# Altium schematic sheet OTHER PARTS.SchDoc
size A3; SheetNumber: 2; SheetTotal: 2
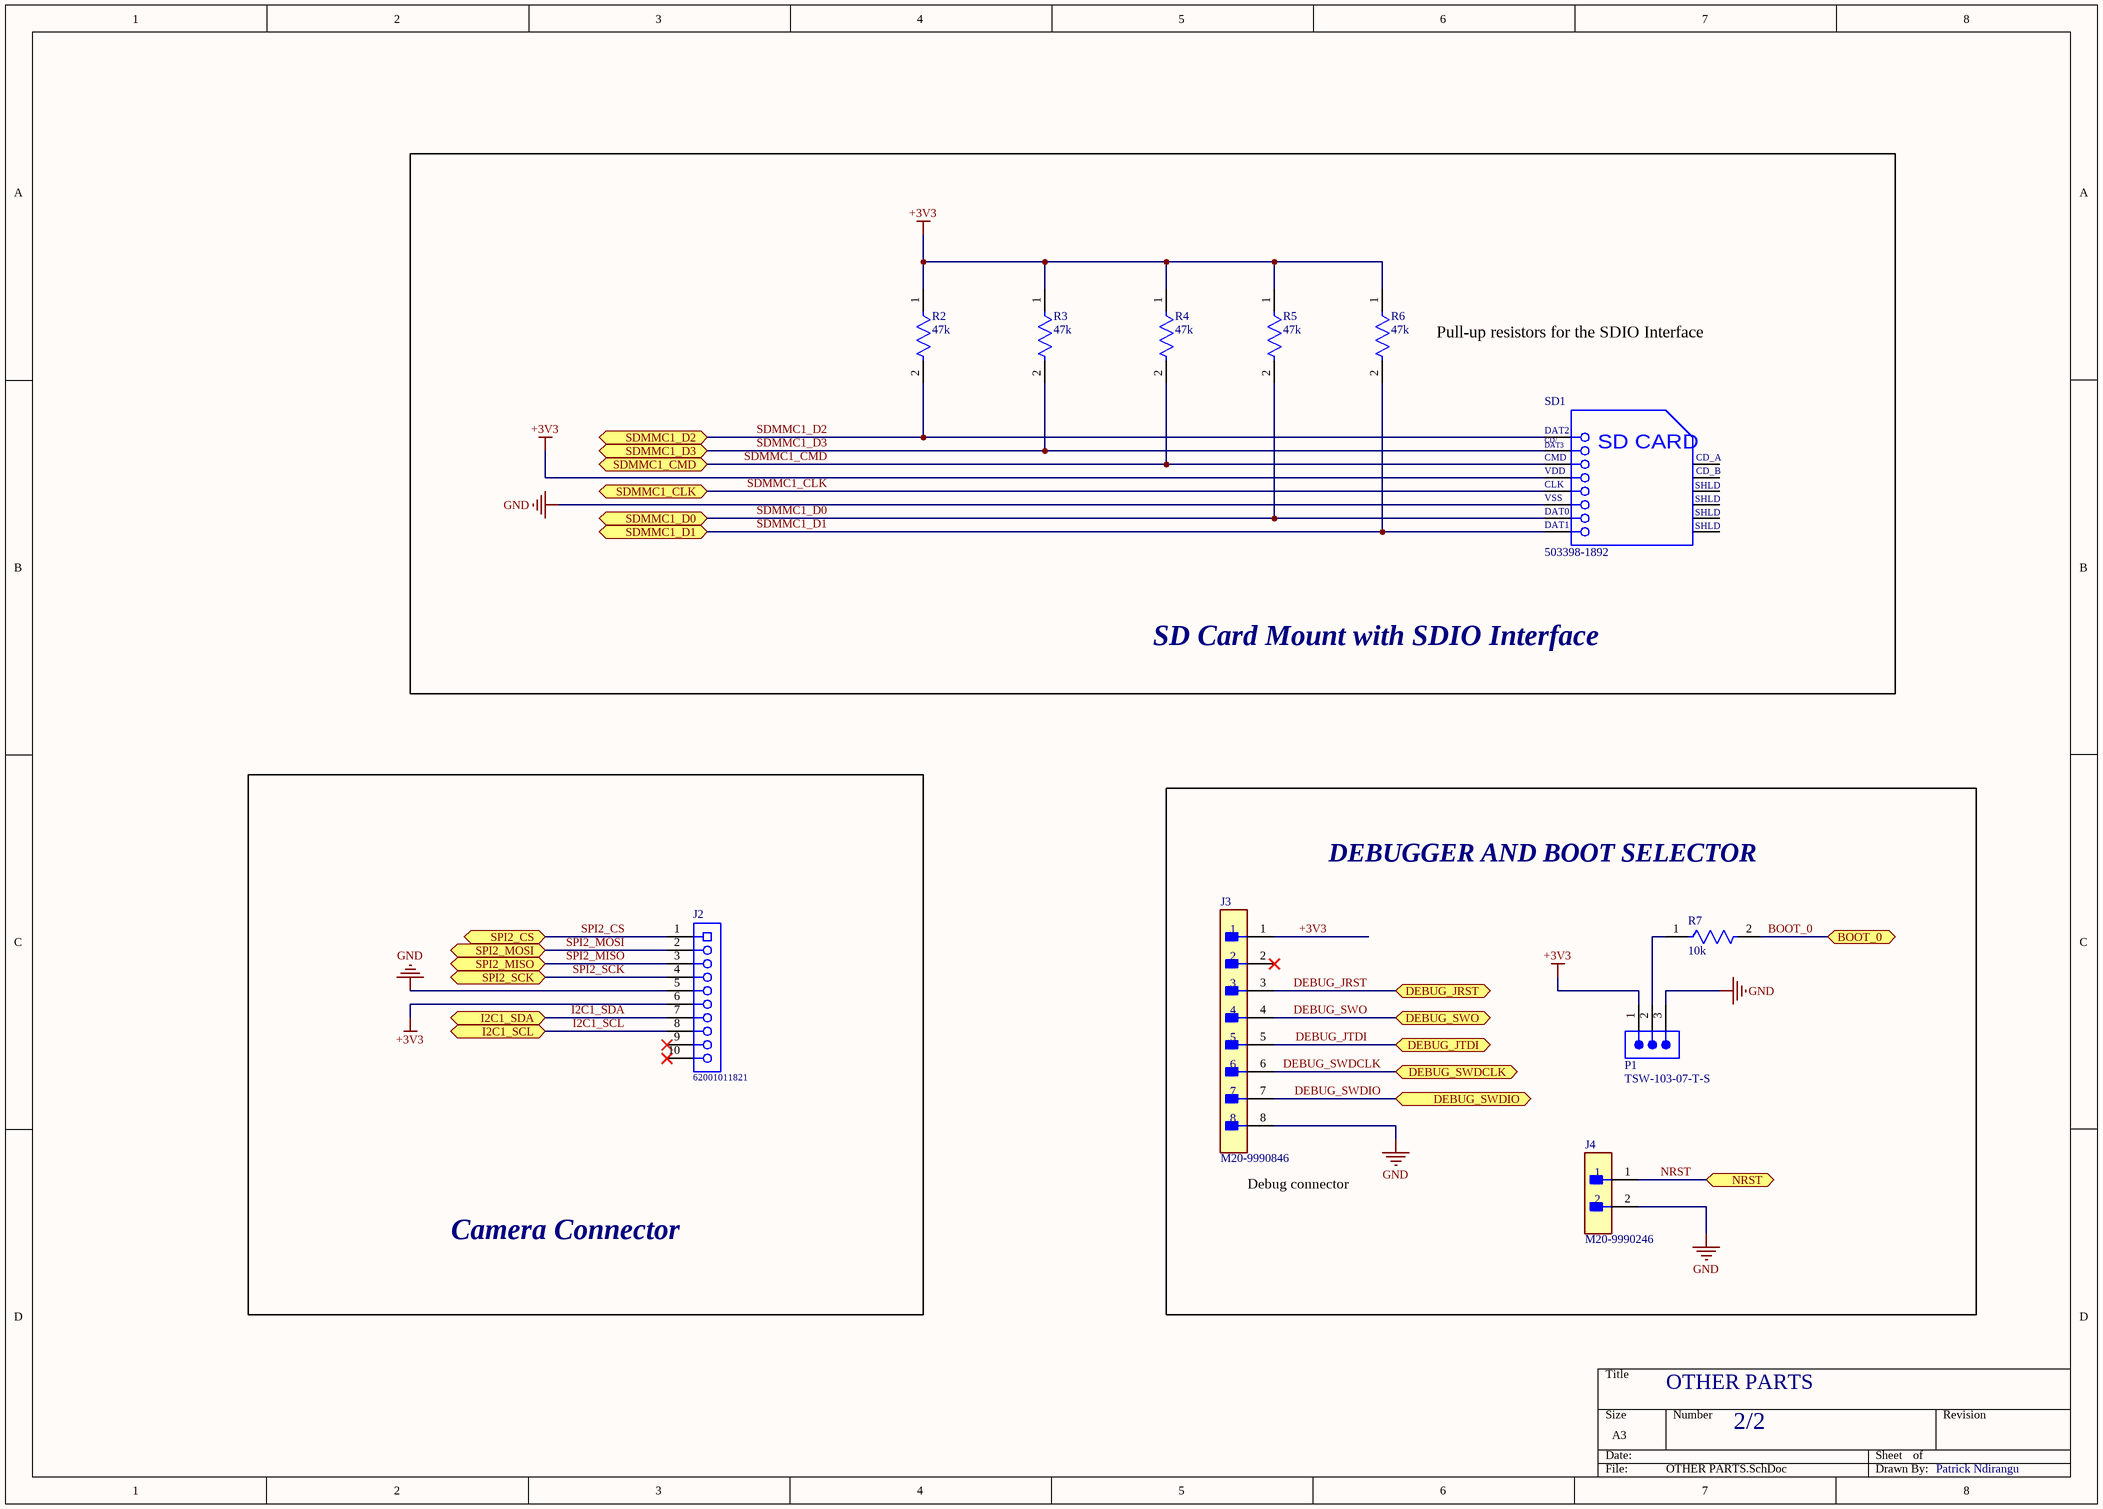
[diagram p0: OTHER PARTS.SchDoc]

## Parts
J2  62001011821  [62001011821]
J3  M20-9990846  [FP-M20-9990846-MFG]
J4  M20-9990246  [FP-M20-9990246-MFG]
P1  TSW-103-07-T-S  [SMTC-TSW-103-07-X-S]
R2  47k  [FP-KTR03-IPC_C]
R3  47k  [FP-KTR03-IPC_C]
R4  47k  [FP-KTR03-IPC_C]
R5  47k  [FP-KTR03-IPC_C]
R6  47k  [FP-KTR03-IPC_C]
R7  10k  [FP-SFR03-MFG]
SD1  503398-1892  [MOLX-503398-1892_V]

## Blocks framed on the sheet
SD Card Mount with SDIO Interface: R2-R6 SD1
Camera Connector: J2
DEBUGGER AND BOOT SELECTOR: J3 J4 P1 R7

## Ports
BOOT_0 (bidir, see MCU[3C]), DEBUG_JRST (bidir, see MCU[3C]), DEBUG_JTDI (bidir, see MCU[1C]), DEBUG_SWDCLK (bidir, see MCU[1C]), DEBUG_SWDIO (bidir, see MCU[1C]), DEBUG_SWO (bidir, see MCU[3C]), I2C1_SCL (bidir, see MCU[3C]), I2C1_SDA (bidir, see MCU[3C]), NRST (bidir, see MCU[3D]), SDMMC1_CLK (bidir, see MCU[1D]), SDMMC1_CMD (bidir, see MCU[3C]), SDMMC1_D0 (bidir, see MCU[1C]), SDMMC1_D1 (bidir, see MCU[1C]), SDMMC1_D2 (bidir, see MCU[1D]), SDMMC1_D3 (bidir, see MCU[1D]), SPI2_CS (bidir, see MCU[3C]), SPI2_MISO (bidir, see MCU[1C]), SPI2_MOSI (bidir, see MCU[1C]), SPI2_SCK (bidir, see MCU[1C])

## Nets
+3V3: J2.6 J3.1 P1.1 R2.1 R3.1 R4.1 R5.1 R6.1 SD1.4(VDD)
GND: J2.5 J3.8 J4.2 P1.3 SD1.6(VSS)
BOOT_0: R7.2 ; port BOOT_0
DEBUG_JRST: J3.3 ; port DEBUG_JRST
DEBUG_JTDI: J3.5 ; port DEBUG_JTDI
DEBUG_SWDCLK: J3.6 ; port DEBUG_SWDCLK
DEBUG_SWDIO: J3.7 ; port DEBUG_SWDIO
DEBUG_SWO: J3.4 ; port DEBUG_SWO
I2C1_SCL: J2.8 ; port I2C1_SCL
I2C1_SDA: J2.7 ; port I2C1_SDA
NRST: J4.1 ; port NRST
SDMMC1_CLK: SD1.5(CLK) ; port SDMMC1_CLK
SDMMC1_CMD: R4.2 SD1.3(CMD) ; port SDMMC1_CMD
SDMMC1_D0: R5.2 SD1.7(DAT0) ; port SDMMC1_D0
SDMMC1_D1: R6.2 SD1.8(DAT1) ; port SDMMC1_D1
SDMMC1_D2: R2.2 SD1.1(DAT2) ; port SDMMC1_D2
SDMMC1_D3: R3.2 SD1.2(CD/DAT3) ; port SDMMC1_D3
SPI2_CS: J2.1 ; port SPI2_CS
SPI2_MISO: J2.3 ; port SPI2_MISO
SPI2_MOSI: J2.2 ; port SPI2_MOSI
SPI2_SCK: J2.4 ; port SPI2_SCK
NetP1_2: P1.2 R7.1

Not connected (* = marked no-connect by the designer): J2 9* 10*; J3 2*; SD1 9(CD_A) 10(CD_B) 11(SHLD) 12(SHLD) 13(SHLD) 14(SHLD)

## Notes on the sheet
- Pull-up resistors for the SDIO Interface
- (near J3) Debug connector
- OTHER PARTS
- 2/2
- Patrick Ndirangu
- (in symbol CMP-2000-05621-1) CD/; DAT3; SD CARD

## Library data of the parts
J2 = CMP-1502-01210-1: THT Vertical Socket Header WR-PHD, Pitch 2.00 mm, Single Row, 10 pins; Manufacturer: Wurth Elektronik; Withstanding Voltage: 500VAC; Gender: Female; Rated Current: 2A; Pin Number: 10; Pitch: 2.00mm; Contact Resistance: 20mOhm; Working Voltage: 250VAC; Mounting Technology: THT; Part Number: 62001011821; Orientation: Vertical; Operating Temperature: -40to105degC; Manufacturer URL: http://www.we-online.de; Publisher: WurthElektronik; Datasheet URL: https://katalog.we-online.de/em/datasheet/62001011821.pdf; Package Reference: 62001011821; Row Number: Single; Packaging: Tube
J3 = CMP-15831-000033-1: CONN HEADER VERT 8POS 2.54MM; Connector Type: Male Pin; Gender: Male; Insulation Resistance: 1GR; Number of Positions: 8; Contact Resistance: 30mR; Current Rating: 3A; Termination: Solder; Case/Package: SIL; RoHS Compliant: Yes; Series: M20; Housing Material: Nylon; Radiation Hardening: No; Package Quantity: 1000; Contact Material: Brass; Contact Plating: Tin; Max Operating Temperature: 105°C; Contact Mating Length: 0.24inch; Depth: 2.54mm; Color: Black; Number of Contacts: 8; Mount: Through Hole; Number of Rows: 1; Packaging: Bulk; Min Operating Temperature: -40°C; Max Current Rating: 3A; REACH SVHC: No SVHC; Pitch: 2.54mm; Housing Color: Black; Orientation: Straight; Length: 20.32mm; Contact Type: Male Pin
J4 = CMP-15831-000009-1: CONN HEADER VERT 2POS 2.54MM; Manufacturer: Harwin; Conn Gender: Male; Conn Orientation: Vertical; Number Of Contacts: 2; Current Rating: 3A; ComponentLink2URL: https://cdn.harwin.com/pdfs/M20-999.pdf; ComponentLink2Description: Datasheet; Package: M20-9990246; Temperature: -40°C to +105°C; Octopart: https://octopart.com/m20-9990246-harwin-2590635; Mouser Description: 2.54mm (0.1") Pitch SIL Vertical PC Tail Pin Header, 6.1mm mating pin height, tin, 2 contacts; Temperature Range High: +105°C; Device Class L1: Connectors; RoHS: TRUE; Automotive: No; Height: 8.99mm; Number Of Rows: 1; Contact Material: Tin,Nickel; Category: Conn; Pitch: 2.54mm; Lead Free: Yes; Digikey Description: CONN HEADER VERT 2POS 2.54MM; Manufacturer Part Number: M20-9990246; Temperature Range Low: -40°C; Device Class L3: unset; Device Class L2: Headers and Wire Housings
P1 = CMP-1024-00332-1: 0.025" SQ Post Header, Through-hole, Vertical, -55 to 105 degC, 2.54 mm Pitch, 3-Pin, Male, RoHS; Manufacturer: Samtec; Pitch: 2.54 mm; ComponentLink1URL: http://www.samtec.com; ComponentLink3URL: http://www.samtec.com/documents/webfiles/cpdf/TSW-XXX-XX-XXX-X-XX-XXX-MKT.pdf; PartNumber: TSW-103-07-T-S; Mounting Technology: Through-hole; RoHS: True; DatasheetVersion: F-214; PackageVersion: DM, 8/1988; Temperature Range: -55 to 105 degC; ComponentLink2Description: Datasheet; ComponentLink1Description: Manufacturer URL; Orientation: Vertical; PackageReference: TSW-103-07-X-S; ComponentLink3Description: Package Specification; ComponentLink2URL: http://www.samtec.com/documents/webfiles/pdf/TSW_TH.PDF; PackageDescription: .025[0.64] SQ. Post Terminal Strip Assembly
R2-R6 = CMP-08839-030818-1: Res Thick Film 0603 47kΩ 1% 0.1W ±100ppm/°C Automotive Paper T/R; Resistance: 47kR; Max Power Dissipation: 100mW; Features: Automotive AEC-Q200; Height: 0.022inch; Package Quantity: 1; Case Code (Metric): 1608; Tolerance: 1%; Case/Package: 0603; Min Operating Temperature: -55°C; Number of Terminations: 2; Width: 0.031inch; Resistor Type: Thick Film; Packaging: Tape and Reel; Max Operating Temperature: 155°C; Length: 0.063inch; Case Code (Imperial): 0603; Temperature Coefficient: 100ppm/°C; Series: KTR
R7 = CMP-08839-031887-1: RES SMD 10K OHM 1% 1/10W 0603; RoHS Compliant: Yes
SD1 = CMP-2000-05621-1: Micro SD Connector, Pitch 1.1 mm, 8 Position, Height 1.4 mm, -25 to 85 degC, RoHS, Tape and Reel; Manufacturer: Molex; Voltage Rating: 10VAC/DC; Current Rating: 500mA; Manufacturer URL: http://www.molex.com/; Package Reference: 503398-1892; Packaging: Reel; RoHS: Details; Brand: Molex; Datasheet URL: http://www.molex.com/pdm_docs/sd/5033981892_sd.pdf; Mounting Technology: SurfaceMount; Factory Pack Quantity: 2400; Datasheet Version: Rev. E, 04/2006; Series: 503398; Product Category: MemoryCardConnectors; Package Description: Micro SD Connector, Pitch 1.1 mm, 8 Position, Height 1.4 mm